# Altium project engine hours meter.PrjPcb
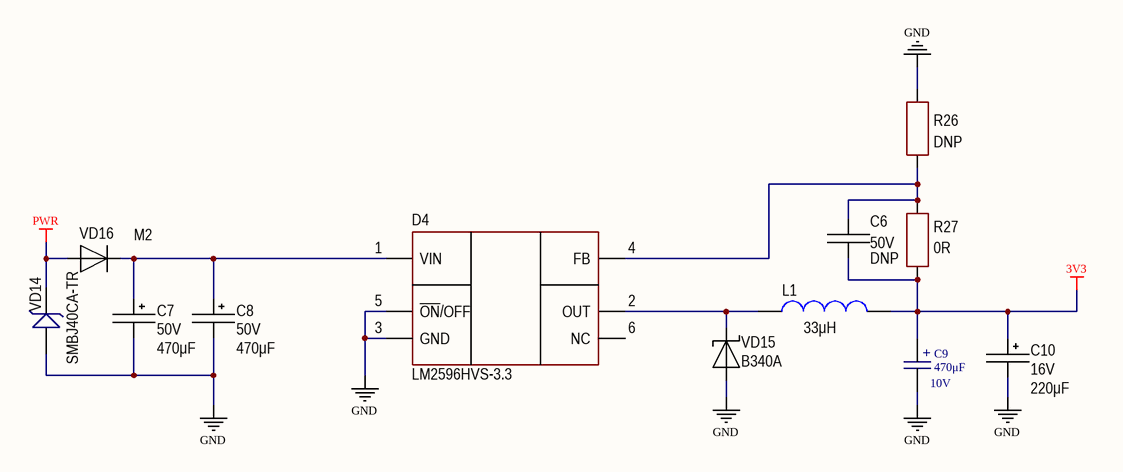
[diagram p0: Power.SchDoc]
6 sheets, 78 parts. Net scope: global (net labels, ports and power ports of the same name join across sheets).
Sheets:
  Power.SchDoc
  Input.SchDoc
  CAN.SchDoc
  Indicators.SchDoc
  Output.SchDoc
  MCU.SchDoc

## Sheet Power.SchDoc
size 420 x 297 mm; SheetNumber: 1; SheetTotal: 6

### Parts
C6  value DNP  Voltage: 50V  [CAP: 1206]
C7  value 470μF  Voltage: 50V  [CAP: D10C5H20]
C8  value 470μF  Voltage: 50V  [CAP: D10C5H20]
C9  value 470μF  Voltage: 10V  [CAP8x10.5]  (hidden comment: Capacitor_Polar)
C10  value 220μF  Voltage: 16V  [CAP: SMD D6.3A6.6H7.7]
D4  (no value)  [TO263-5L]
L1  value 33μH  [IND: SRP7028A]
R26  value DNP  [RES: 1206]
R27  value 0R  [RES: 1206]
VD14  value SMBJ40CA-TR  [SMB]  (hidden comment: suppressor)
VD15  PartNumber: B340A  [DIODE: SMA]
VD16  PartNumber: M2  [DIODE: SMA]

### Nets
3V3: C6.1 C9.1 C10.1 L1.1 R27.1
GND: C7.2 C8.2 C9.2 C10.2 D4.3(GND) D4.5(~{ON}/OFF) R26.2 VD14.2 VD15.1
PWR: VD14.1 VD16.1
NetC6_2: C6.2 D4.4(FB) R26.1 R27.2
NetC7_1: C7.1 C8.1 D4.1(VIN) VD16.2
NetD4_2: D4.2(OUT) L1.2 VD15.2

Not connected (* = marked no-connect by the designer): D4 6(NC)

### Notes on the sheet
- Подп. и дата
- Инв. № дубл.
- Взам. инв. №
- Инв. № подл.
- Изм.
- Лист
- № докум.
- Подп.
- Дата
- 2.106-A3
- Копировал
- Формат А3
- (in symbol Capacitor_Polar) +

### Library data of the parts
C6 = Ceramic_1206: Manufacturer: Yageo; PartNumber: CC1206KRX7R9BB104; ValueManufacturerPartNumber: Ceramic capacitor, DNP, X7R, ±10%, 50V, 1206, -55...+125°C; TypeCapacitor: Ceramic capacitor; Tolerance: ±10%; TypeDielectric: X7R; Package: 1206; HelpURL: https://www.digikey.com/product-detail/en/yageo/CC1206KRX7R9BB104/311-1179-1-ND/303089; Temperature: -55...+125°C
C7 C8 = Aluminium: ECAP (К50-35), 470мкФ, 50В, 105°C, 20%, 10x20мм P:5мм; Manufacturer: Wurth; ValueManufacturerPartNumber: Aluminium capacitor, 470μF, 50V, ±20%, 54mOhm, 14x10x5 mm, -55...+105°C; TypeCapacitor: Aluminium capacitor; Impedance: 54mOhm; PartNumber: ECAP (К50-35); Package: 14x10x5 mm; HelpURL: https://www.digikey.com/product-detail/en/wurth-electronics-inc/860080475013/732-9029-1-ND/5728972; Temperature: -55...+105°C; Tolerance: ±20%
C9 = Capacitor_Polar: PartNumber: JCK1A471M080105
C10 = Aluminium: Manufacturer: Wurth; PartNumber: JCK1C221M063077; ValueManufacturerPartNumber: Aluminium capacitor, 220μF, 16V, ±20%, 54mOhm, 14x10x5 mm, -55...+105°C; TypeCapacitor: Aluminium capacitor; Tolerance: ±20%; Impedance: 54mOhm; Package: 14x10x5 mm; HelpURL: https://www.digikey.com/product-detail/en/wurth-electronics-inc/860080475013/732-9029-1-ND/5728972; Temperature: -55...+105°C
D4 = LM2596HVS-3.3: Buck converter; Manufacturer: Texas Instruments; ValueManufacturerPartNumber: DC/DC buck converter, 45V, 52MHz, 3.3V, 5A, -40...+125°C, TO263-5L; VoltageInput: 45V; Frequency: 52MHz; CurrentOutput: 5A; VoltageOutput: 3.3V; Package: TO263-5L; ComponentType: DC/DC buck converter; Temperature: -40...+125°C; PartNumber: LM2596HVS-3.3
L1 = Inductor_SRP7028A: FAUL0630-330MT / BMRA00060630330MA1; Manufacturer: Bourns; PartNumber: SRP7028A-330M; ValueManufacturerPartNumber: Fixed inductor, 33μH, ±20%, SRP7028A, 5.5A, -40...+150°C; TypeInductor: Fixed inductor; MaxCurrent: 5.5A; Tolerance: ±20%; Package: SRP7028A; Temperature: -40...+150°C
R26 = Resistor_1206: Manufacturer: Yageo; PartNumber: RC1206JR-07100RL; ValueManufacturerPartNumber: Resistor film, DNP, ±5%, 1206, 0.25W, -55...+125°C; TypeResistor: Resistor film; Power: 0.25W; Tolerance: ±5%; Package: 1206; HelpURL: https://www.digikey.com/product-detail/en/yageo/RC1206JR-07100RL/311-100ERCT-ND/732153; Temperature: -55...+125°C
R27 = Resistor_1206: Manufacturer: Yageo; PartNumber: RC1206JR-07100RL; ValueManufacturerPartNumber: Resistor film, 0R, ±5%, 1206, 0.25W, -55...+125°C; TypeResistor: Resistor film; Power: 0.25W; Tolerance: ±5%; Package: 1206; HelpURL: https://www.digikey.com/product-detail/en/yageo/RC1206JR-07100RL/311-100ERCT-ND/732153; Temperature: -55...+125°C
VD15 = Schottky_single: ValueManufacturerPartNumber: Schottky diode, 80V, 500mA, 1V, 15pF, SMA, -55...+150°C; TypeDiode: Schottky diode; Voltage: 80V; Current: 500mA; VoltageDrop: 1V; RecoveryTime: 15pF; Package: SMA; HelpURL: https://www.chipdip.ru/product/b340a; Temperature: -55...+150°C
VD16 = Diode_single: Manufacturer: Micro Commercial; ValueManufacturerPartNumber: Single diode, 75V, 150mA, 1V, 4ns, SOD-323, -55...+150°C; TypeDiode: Single diode; Voltage: 75V; Current: 150mA; VoltageDrop: 1V; RecoveryTime: 4ns; Package: SOD-323; HelpURL: https://www.digikey.com/product-detail/en/micro-commercial-co/1N4148WX-TP/1N4148WXTPMSCT-ND/717312; Temperature: -55...+150°C

## Sheet Input.SchDoc
size 420 x 297 mm; SheetNumber: 2; SheetTotal: 6
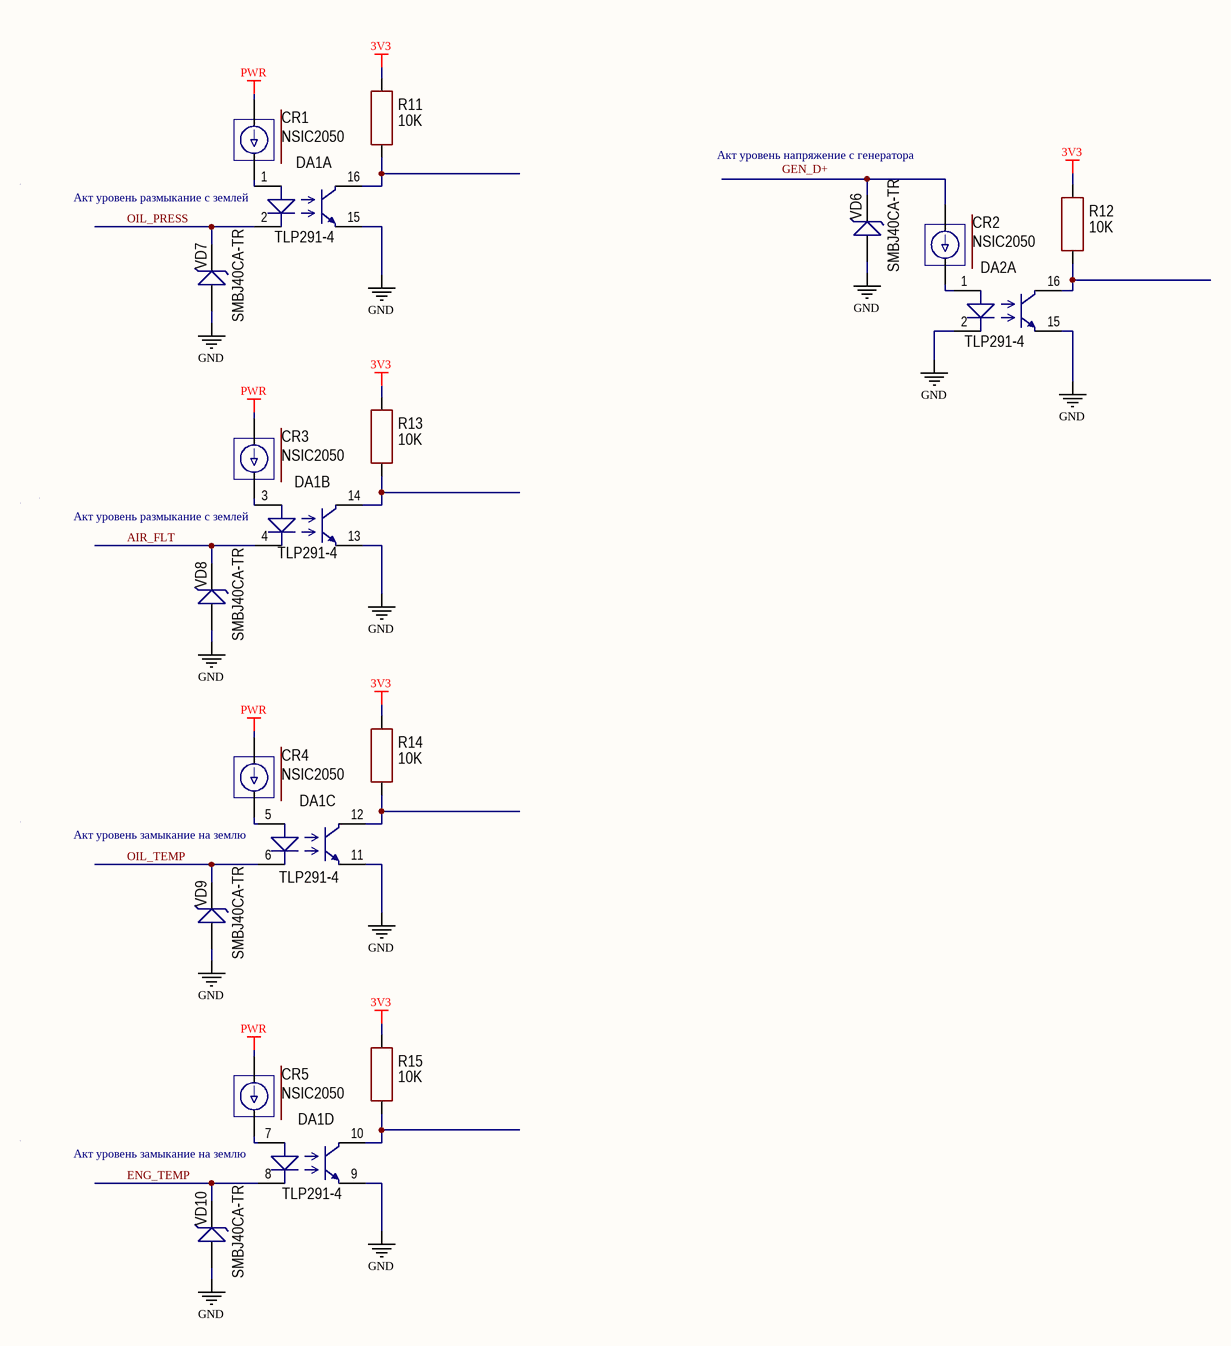
[diagram p1: Input.SchDoc]

### Parts
CR1  value NSIC2050  [SMB1]  (hidden comment: NSIC20XX)
CR2  value NSIC2050  [SMB1]  (hidden comment: NSIC20XX)
CR3  value NSIC2050  [SMB1]  (hidden comment: NSIC20XX)
CR4  value NSIC2050  [SMB1]  (hidden comment: NSIC20XX)
CR5  value NSIC2050  [SMB1]  (hidden comment: NSIC20XX)
DA1  TLP291-4  [SOP16]  (parts A,B,C,D of 4)
DA2  TLP291-4  [SOP16]  (part A of 4)
R11  value 10K  [RES: 1206]
R12  value 10K  [RES: 1206]
R13  value 10K  [RES: 1206]
R14  value 10K  [RES: 1206]
R15  value 10K  [RES: 1206]
VD6  value SMBJ40CA-TR  [SMB]  (hidden comment: suppressor)
VD7  value SMBJ40CA-TR  [SMB]  (hidden comment: suppressor)
VD8  value SMBJ40CA-TR  [SMB]  (hidden comment: suppressor)
VD9  value SMBJ40CA-TR  [SMB]  (hidden comment: suppressor)
VD10  value SMBJ40CA-TR  [SMB]  (hidden comment: suppressor)

### Nets
3V3: R11.2 R12.2 R13.2 R14.2 R15.2
GND: DA1.9 DA1.11 DA1.13 DA1.15 DA2.2 DA2.15 VD6.2 VD7.2 VD8.2 VD9.2 VD10.2
PWR: CR1.A CR3.A CR4.A CR5.A
AIR_FLT: DA1.4 VD8.1
ENG_TEMP: DA1.8 VD10.1
OIL_PRESS: DA1.2 VD7.1
OIL_TEMP: DA1.6 VD9.1
NetCR1_K: CR1.K DA1.1
NetCR2_A: CR2.A VD6.1
NetCR2_K: CR2.K DA2.1
NetCR3_K: CR3.K DA1.3
NetCR4_K: CR4.K DA1.5
NetCR5_K: CR5.K DA1.7
NetDA1_10: DA1.10 R15.1
NetDA1_12: DA1.12 R14.1
NetDA1_14: DA1.14 R13.1
NetDA1_16: DA1.16 R11.1
NetDA2_16: DA2.16 R12.1

### Notes on the sheet
- Акт уровень напряжение с генератора
- (near DA1) Акт уровень размыкание с землей
- Акт уровень замыкание на землю
- Labels drawn without touching a wire or pin: GEN_D+
- Подп. и дата
- Инв. № дубл.
- Взам. инв. №
- Инв. № подл.
- Изм.
- Лист
- № докум.
- Подп.
- Дата
- 2.106-A3
- Копировал
- Формат А3

### Library data of the parts
CR1-CR5 = NSIC20XX: pin to pad: A>2 K>1
R11-R15 = Resistor_1206: Manufacturer: Yageo; PartNumber: RC1206JR-07100RL; ValueManufacturerPartNumber: Resistor film, 10K, ±5%, 1206, 0.25W, -55...+125°C; TypeResistor: Resistor film; Power: 0.25W; Tolerance: ±5%; Package: 1206; HelpURL: https://www.digikey.com/product-detail/en/yageo/RC1206JR-07100RL/311-100ERCT-ND/732153; Temperature: -55...+125°C
DA1 DA2 = TLP291-4: Value: TLP291-4

## Sheet CAN.SchDoc
size 420 x 297 mm; SheetNumber: 3; SheetTotal: 6
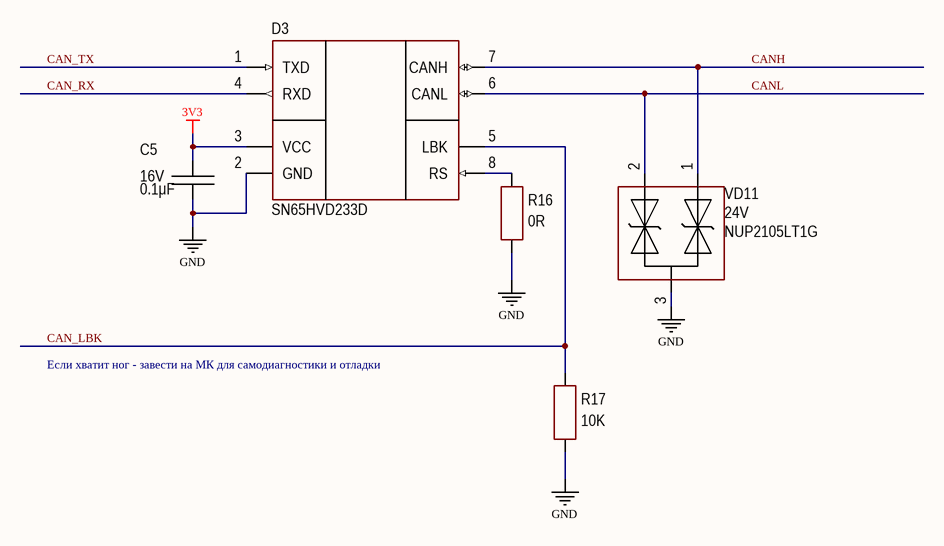
[diagram p2: CAN.SchDoc]

### Parts
C5  value 0.1μF  Voltage: 16V  [CAP: 0805]
D3  PartNumber: SN65HVD233D  [8-SOIC]
R16  value 0R  [RES: 1206]
R17  value 10K  [RES: 1206]
VD11  Voltage: 24V  PartNumber: NUP2105LT1G  [SOT23]

### Nets
3V3: C5.2 D3.3(VCC)
GND: C5.1 D3.2(GND) R16.1 R17.1 VD11.3
CAN_LBK: D3.5(LBK) R17.2
CAN_RX: D3.4(RXD)
CAN_TX: D3.1(TXD)
CANH: D3.7(CANH) VD11.1
CANL: D3.6(CANL) VD11.2
NetD3_8: D3.8(RS) R16.2

### Notes on the sheet
- Если хватит ног - завести на МК для самодиагностики и отладки
- Подп. и дата
- Инв. № дубл.
- Взам. инв. №
- Инв. № подл.
- Изм.
- Лист
- № докум.
- Подп.
- Дата
- 2.106-A3
- Копировал
- Формат А3

### Library data of the parts
C5 = Ceramic_0805: Manufacturer: Yageo; PartNumber: CC0805KRX7R7BB104; ValueManufacturerPartNumber: Ceramic capacitor, 0.1μF, X7R, ±10%, 16V, 0805, -55...+125°C; TypeCapacitor: Ceramic capacitor; Tolerance: ±10%; TypeDielectric: X7R; Package: 0805; HelpURL: https://www.digikey.com/product-detail/en/yageo/CC0805KRX7R7BB104/311-1142-1-ND/303052; Temperature: -55...+125°C
D3 = SN65HVD231DR: CAN; Manufacturer: Texas Instruments; ValueManufacturerPartNumber: IC CAN transceiver, 1Mbps, Half-duplex, 3...3.6V, -40...+85°C, 8-SOIC; Supply: 3...3.6V; DataRate: 1Mbps; TypeDuplex: Half-duplex; HelpURL: https://www.digikey.com/product-detail/en/texas-instruments/SN65HVD231DR/296-26343-1-ND/2254977; Package: 8-SOIC; ComponentType: IC CAN transceiver; Temperature: -40...+85°C
R16 = Resistor_1206: as R27 on sheet Power; Package: 1206; HelpURL: https://www.digikey.com/product-detail/en/yageo/RC1206JR-07100RL/311-100ERCT-ND/732153; Temperature: -55...+125°C
R17 = Resistor_1206: as R11 on sheet Input; Package: 1206; HelpURL: https://www.digikey.com/product-detail/en/yageo/RC1206JR-07100RL/311-100ERCT-ND/732153; Temperature: -55...+125°C
VD11 = TVS_array: Manufacturer: Diodes Incorporated; ValueManufacturerPartNumber: Zener diode, 24V, 500mW, 0.9V, 17Ohm, SOD-123, -55...+150°C; TypeDiode: Zener diode; Current: 500mW; VoltageDrop: 0.9V; RecoveryTime: 17Ohm; Package: SOD-123; HelpURL: https://www.digikey.com/product-detail/en/diodes-incorporated/MMSZ5231B-7-F/MMSZ5231B-FDICT-ND/755506; Temperature: -55...+150°C

## Sheet Indicators.SchDoc
size 420 x 297 mm; SheetNumber: 4; SheetTotal: 6
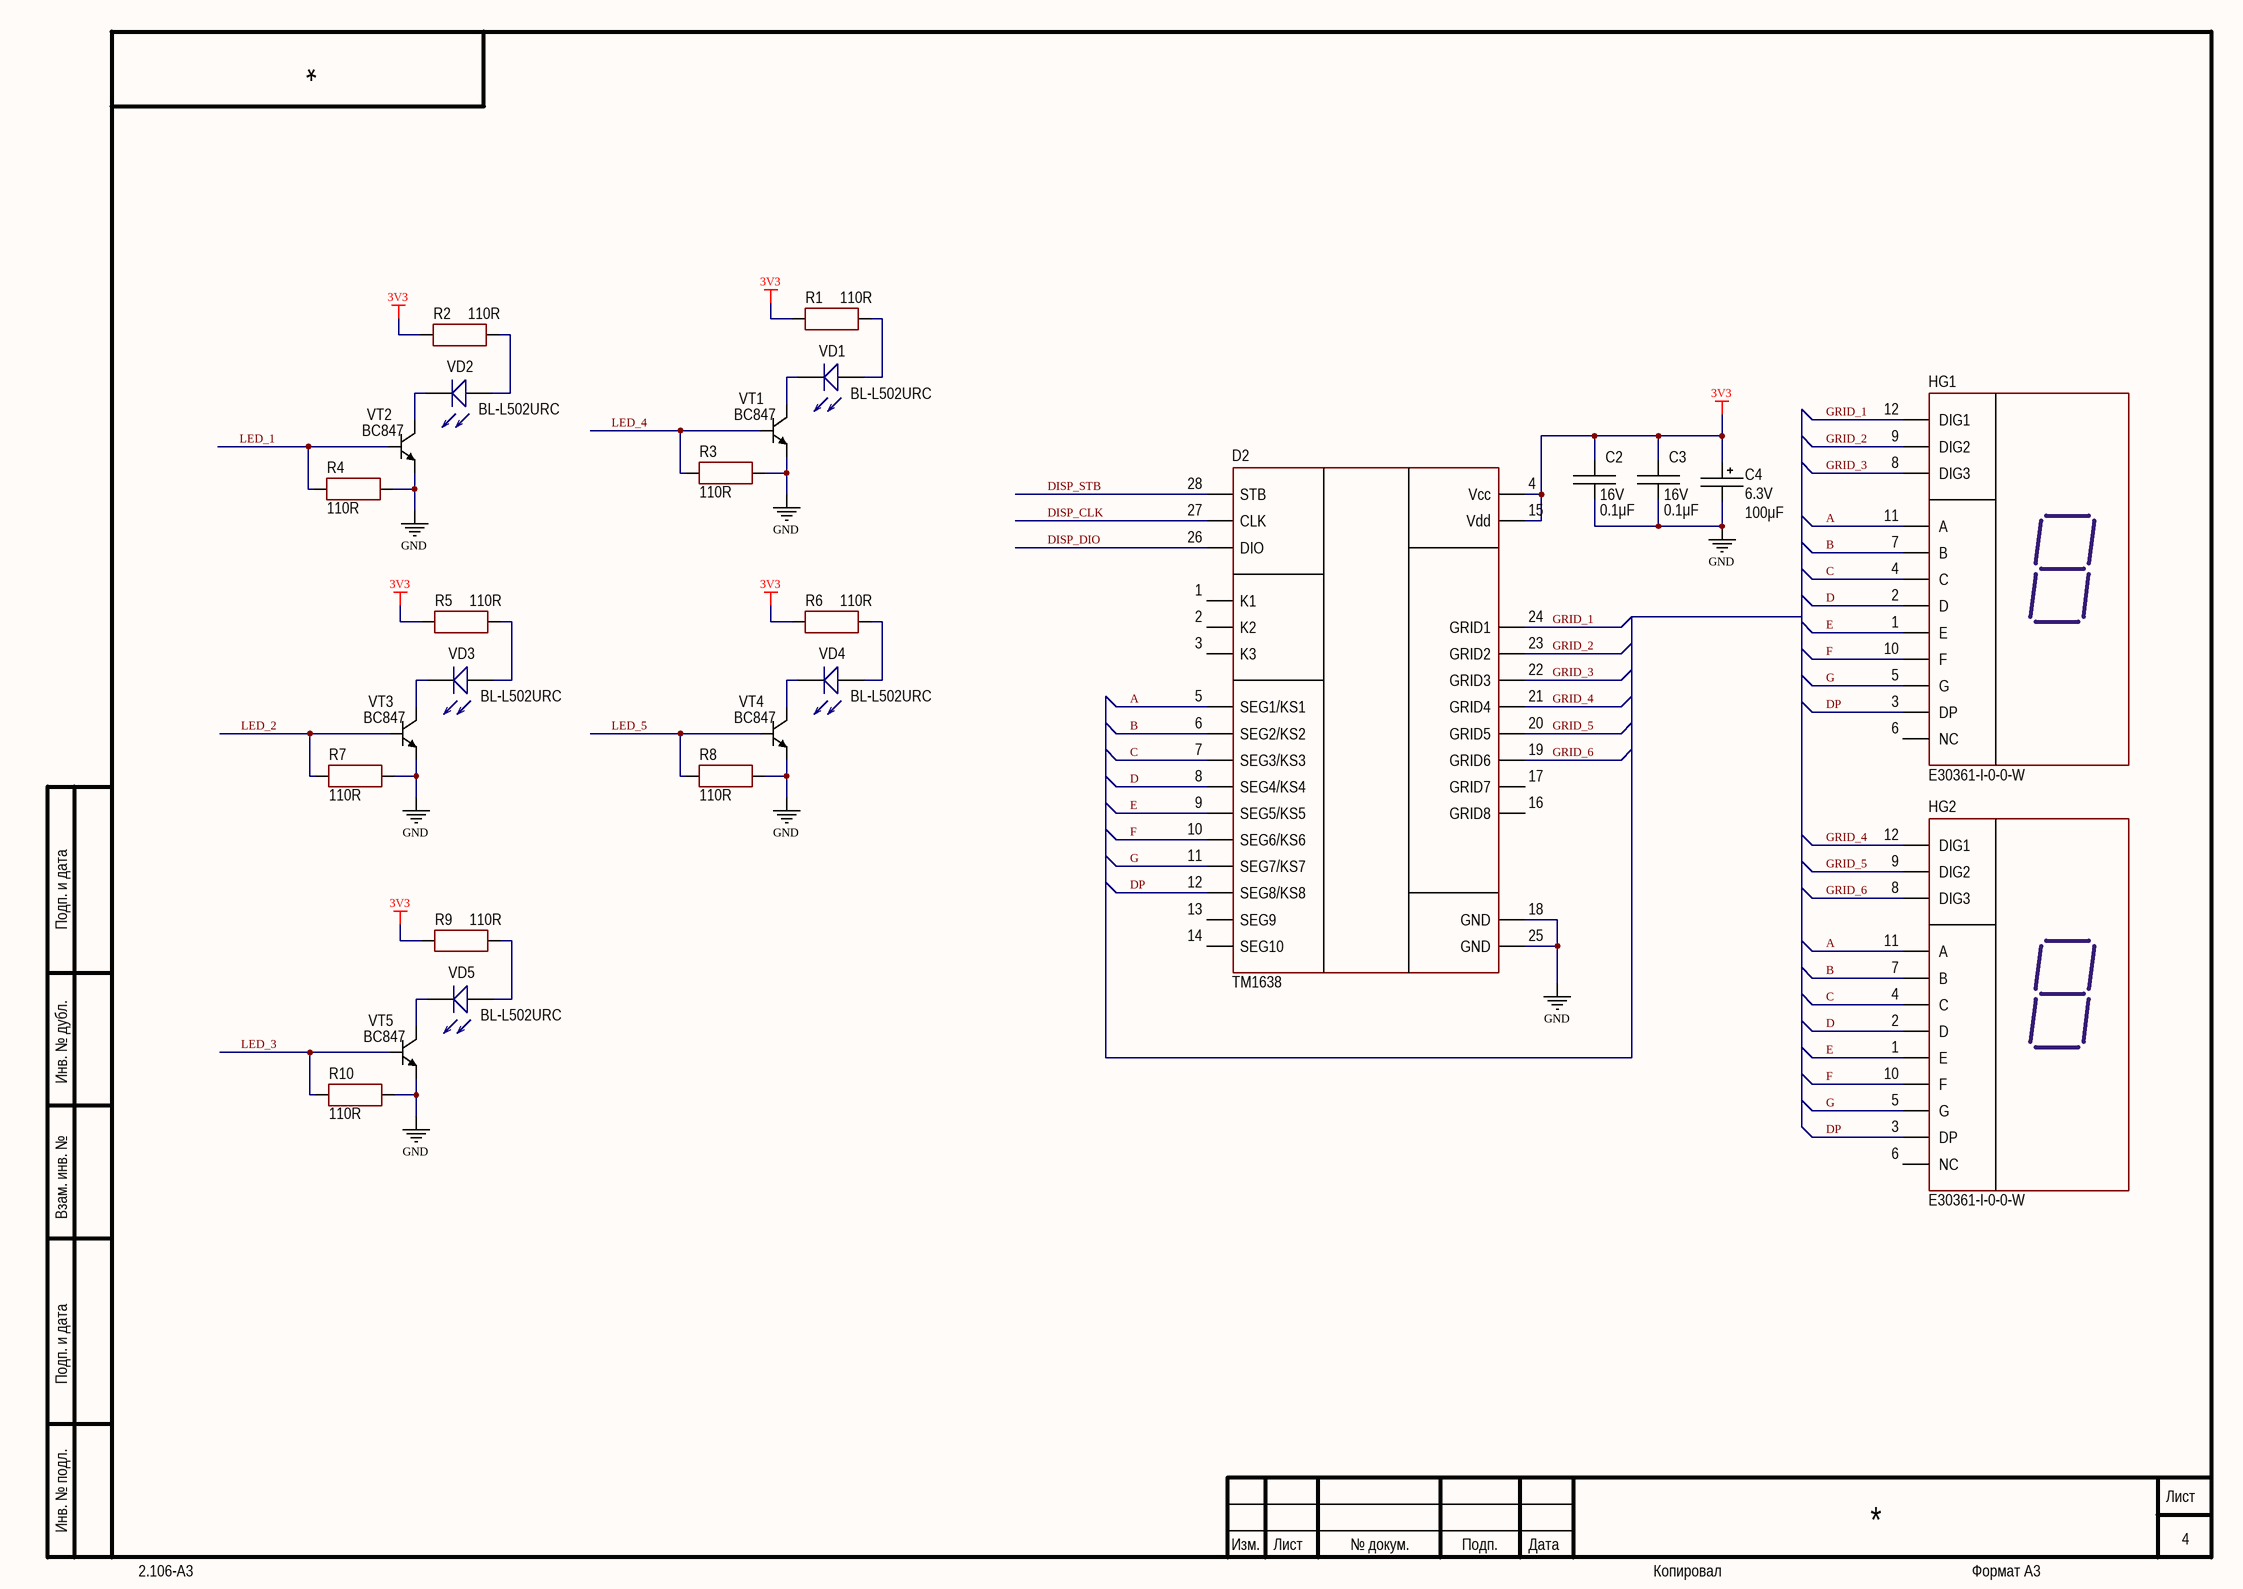
[diagram p3: Indicators.SchDoc]

### Parts
C2  value 0.1μF  Voltage: 16V  [CAP: 0805]
C3  value 0.1μF  Voltage: 16V  [CAP: 0805]
C4  value 100μF  Voltage: 6.3V  [CAP: TANTAL-C]
D2  (no value)  [28-SOP]
HG1  PartNumber: E30361-I-0-0-W  [DISP: CL3631BH - GREEN (0,36")]
HG2  PartNumber: E30361-I-0-0-W  [DISP: CL3631BH - GREEN (0,36")]
R1  value 110R  [RES: 1206]
R2  value 110R  [RES: 1206]
R3  value 110R  [RES: 1206]
R4  value 110R  [RES: 1206]
R5  value 110R  [RES: 1206]
R6  value 110R  [RES: 1206]
R7  value 110R  [RES: 1206]
R8  value 110R  [RES: 1206]
R9  value 110R  [RES: 1206]
R10  value 110R  [RES: 1206]
VD1  LED  [LED 5mm RED]  (value not drawn)
VD2  LED  [LED 5mm RED]  (value not drawn)
VD3  LED  [LED 5mm RED]  (value not drawn)
VD4  LED  [LED 5mm RED]  (value not drawn)
VD5  LED  [LED 5mm RED]  (value not drawn)
VT1  PartNumber: BC847  [SOT23]
VT2  PartNumber: BC847  [SOT23]
VT3  PartNumber: BC847  [SOT23]
VT4  PartNumber: BC847  [SOT23]
VT5  PartNumber: BC847  [SOT23]

### Nets
3V3: C2.2 C3.2 C4.1 D2.4(Vcc) D2.15(Vdd) R1.2 R2.2 R5.2 R6.2 R9.2
GND: C2.1 C3.1 C4.2 D2.18(GND) D2.25(GND) R3.1 R4.1 R7.1 R8.1 R10.1 VT1.2(E) VT2.2(E) VT3.2(E) VT4.2(E) VT5.2(E)
A: D2.5(SEG1/KS1) HG1.11(A) HG2.11(A)
B: D2.6(SEG2/KS2) HG1.7(B) HG2.7(B)
C: D2.7(SEG3/KS3) HG1.4(C) HG2.4(C)
D: D2.8(SEG4/KS4) HG1.2(D) HG2.2(D)
DISP_CLK: D2.27(CLK)
DISP_DIO: D2.26(DIO)
DISP_STB: D2.28(STB)
DP: D2.12(SEG8/KS8) HG1.3(DP) HG2.3(DP)
E: D2.9(SEG5/KS5) HG1.1(E) HG2.1(E)
F: D2.10(SEG6/KS6) HG1.10(F) HG2.10(F)
G: D2.11(SEG7/KS7) HG1.5(G) HG2.5(G)
GRID_1: D2.24(GRID1) HG1.12(DIG1)
GRID_2: D2.23(GRID2) HG1.9(DIG2)
GRID_3: D2.22(GRID3) HG1.8(DIG3)
GRID_4: D2.21(GRID4) HG2.12(DIG1)
GRID_5: D2.20(GRID5) HG2.9(DIG2)
GRID_6: D2.19(GRID6) HG2.8(DIG3)
LED_1: R4.2 VT2.1(B)
LED_2: R7.2 VT3.1(B)
LED_3: R10.2 VT5.1(B)
LED_4: R3.2 VT1.1(B)
LED_5: R8.2 VT4.1(B)
NetR1_1: R1.1 VD1.2
NetR2_1: R2.1 VD2.2
NetR5_1: R5.1 VD3.2
NetR6_1: R6.1 VD4.2
NetR9_1: R9.1 VD5.2
NetVD1_1: VD1.1 VT1.3(C)
NetVD2_1: VD2.1 VT2.3(C)
NetVD3_1: VD3.1 VT3.3(C)
NetVD4_1: VD4.1 VT4.3(C)
NetVD5_1: VD5.1 VT5.3(C)

Not connected (* = marked no-connect by the designer): D2 1(K1) 2(K2) 3(K3) 13(SEG9) 14(SEG10) 16(GRID8) 17(GRID7); HG1 6(NC); HG2 6(NC)

### Notes on the sheet
- Подп. и дата
- Инв. № дубл.
- Взам. инв. №
- Инв. № подл.
- Изм.
- Лист
- № докум.
- Подп.
- Дата
- 2.106-A3
- Копировал
- Формат А3

### Library data of the parts
C2 C3 = Ceramic_0805: as C5 on sheet CAN; Package: 0805; HelpURL: https://www.digikey.com/product-detail/en/yageo/CC0805KRX7R7BB104/311-1142-1-ND/303052; Temperature: -55...+125°C
C4 = Tantal_C: Manufacturer: AVX; PartNumber: F931E226MCC; ValueManufacturerPartNumber: Tantalum capacitor, 100μF, 6.3V, ±10%, 1.1Ohm, case C (6032), -55...+125°C; Impedance: 1.1Ohm; Tolerance: ±10%; TypeDielectric: X7R; TypeCapacitor: Tantalum capacitor; Package: case C (6032); HelpURL: https://www.digikey.com/product-detail/en/avx-corporation/F931E226MCC/478-8314-1-ND/4006045; Temperature: -55...+125°C
D2 = TM1638: 7-seg LED Driver; Manufacturer: TM(Shenzhen Titan Micro Elec); ValueManufacturerPartNumber: LED Display driver, 480 Mb/s, ULPI, USB, 3...3.6V, -40...+85°C, SOP-28; Supply: 3...3.6V; DataRate: 480 Mb/s; Protocol: ULPI, USB; HelpURL: https://www.lcsc.com/product-detail/span-style-background-color-ff0-LED-span-Display-Drivers_TM-Shenzhen-Titan-Micro-Elec-TM1638_C19187.html; Package: SOP-28; ComponentType: LED Display driver; Temperature: -40...+85°C; PartNumber: TM1638
HG1 HG2 = E30361: 7 segment LED indicator 3 dig; Package: 14х22,5; ComponentType: 7Seg LED; ValueManufacturerPartNumber: =ComponentType+', '+TypeStandart+', '+Core+', '+TypeInterface+', '+Temperature+', '+Package; Temperature: -40...+85°C
R1-R10 = Resistor_1206: Manufacturer: Yageo; PartNumber: RC1206JR-07100RL; ValueManufacturerPartNumber: Resistor film, 110R, ±5%, 1206, 0.25W, -55...+125°C; TypeResistor: Resistor film; Power: 0.25W; Tolerance: ±5%; Package: 1206; HelpURL: https://www.digikey.com/product-detail/en/yageo/RC1206JR-07100RL/311-100ERCT-ND/732153; Temperature: -55...+125°C
VD1-VD5 = LED: BL-L502URC; Value: LED; PartNumber: BL-L502URC
VT1-VT5 = BJT_NPN_132: Manufacturer: ON Semiconductor; ValueManufacturerPartNumber: NPN transistor, 45V, 100mA, 100MHz, 300mW, 0.6V, 420, SOT-23, -55...+125°C; TypeTransistor: NPN transistor; VoltageCE: 45V; CurrentCE: 100mA; VoltageSaturation: 0.6V; Frequency: 100MHz; CurrentGain: 420; MaxPower: 300mW; Package: SOT-23; HelpURL: https://www.digikey.com/product-detail/en/on-semiconductor/BC847CLT1G/BC847CLT1GOSCT-ND/917836; Temperature: -55...+125°C

## Sheet Output.SchDoc
size 420 x 297 mm; SheetNumber: 5; SheetTotal: 6
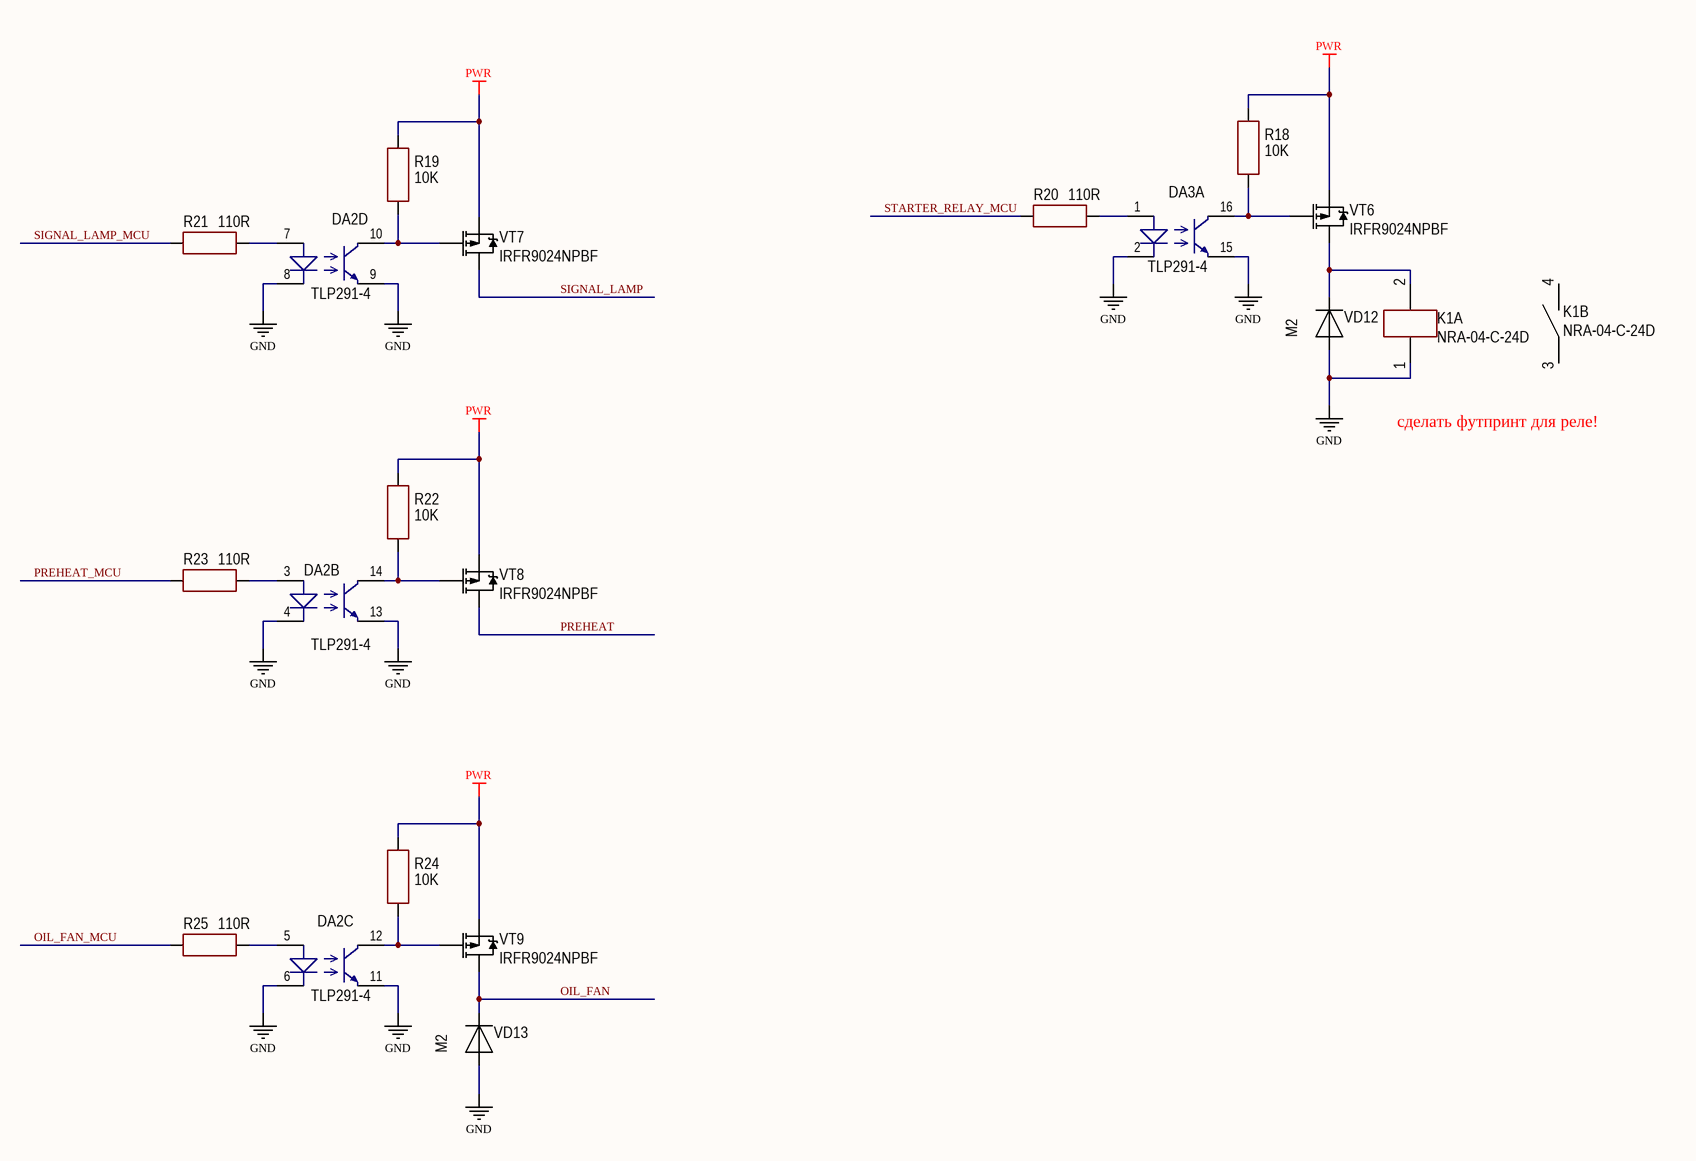
[diagram p4: Output.SchDoc]

### Parts
DA2  TLP291-4  [SOP16]  (parts B,C,D of 4)
DA3  TLP291-4  [SOP16]  (part A of 4)
K1  PartNumber: NRA-04-C-24D  [REL: T9GS1]  (parts A,B of 2)
R18  value 10K  [RES: 1206]
R19  value 10K  [RES: 1206]
R20  value 110R  [RES: 1206]
R21  value 110R  [RES: 1206]
R22  value 10K  [RES: 1206]
R23  value 110R  [RES: 1206]
R24  value 10K  [RES: 1206]
R25  value 110R  [RES: 1206]
VD12  PartNumber: M2  [DIODE: SMA]
VD13  PartNumber: M2  [DIODE: SMA]
VT6  PartNumber: IRFR9024NPBF  [DPAK]
VT7  PartNumber: IRFR9024NPBF  [DPAK]
VT8  PartNumber: IRFR9024NPBF  [DPAK]
VT9  PartNumber: IRFR9024NPBF  [DPAK]

### Nets
GND: DA2.4 DA2.6 DA2.8 DA2.9 DA2.11 DA2.13 DA3.2 DA3.15 K1.1 VD12.1 VD13.1
PWR: R18.2 R19.2 R22.2 R24.2 VT6.3(S) VT7.3(S) VT8.3(S) VT9.3(S)
OIL_FAN: VD13.2 VT9.2(D)
OIL_FAN_MCU: R25.2
PREHEAT: VT8.2(D)
PREHEAT_MCU: R23.2
SIGNAL_LAMP: VT7.2(D)
SIGNAL_LAMP_MCU: R21.2
STARTER_RELAY_MCU: R20.2
NetDA2_3: DA2.3 R23.1
NetDA2_5: DA2.5 R25.1
NetDA2_7: DA2.7 R21.1
NetDA2_10: DA2.10 R19.1 VT7.1(G)
NetDA2_12: DA2.12 R24.1 VT9.1(G)
NetDA2_14: DA2.14 R22.1 VT8.1(G)
NetDA3_1: DA3.1 R20.1
NetDA3_16: DA3.16 R18.1 VT6.1(G)
NetK1_2: K1.2 VD12.2 VT6.2(D)

Not connected (* = marked no-connect by the designer): K1 3 4

### Notes on the sheet
- сделать футпринт для реле!
- Подп. и дата
- Инв. № дубл.
- Взам. инв. №
- Инв. № подл.
- Изм.
- Лист
- № докум.
- Подп.
- Дата
- 2.106-A3
- Копировал
- Формат А3

### Library data of the parts
K1 = Relay_T9GS1L14: Manufacturer: TE Connectivity; ValueManufacturerPartNumber: Electromechanics relay, 12VDC, 480VAC, 30A, 1NO, -40...+85°C; TypeRelay: Electromechanics relay; VoltageMax: 480VAC; VoltageControlCoil: 12VDC; MaxCurrent: 30A; Package: 1NO; HelpURL: https://www.digikey.com/products/en?keywords=T9GS1L14-12; Temperature: -40...+85°C
R18 R19 R22 R24 = Resistor_1206: as R11 on sheet Input; Package: 1206; HelpURL: https://www.digikey.com/product-detail/en/yageo/RC1206JR-07100RL/311-100ERCT-ND/732153; Temperature: -55...+125°C
R20 R21 R23 R25 = Resistor_1206: as R1 on sheet Indicators; Package: 1206; HelpURL: https://www.digikey.com/product-detail/en/yageo/RC1206JR-07100RL/311-100ERCT-ND/732153; Temperature: -55...+125°C
VD12 VD13 = Diode_single: as VD16 on sheet Power; Package: SOD-323; HelpURL: https://www.digikey.com/product-detail/en/micro-commercial-co/1N4148WX-TP/1N4148WXTPMSCT-ND/717312; Temperature: -55...+150°C
VT6-VT9 = MOSFET_P_123: Manufacturer: Infineon Technologies; ValueManufacturerPartNumber: MOSFET P-channel transistor, 20V, 2.6A, 2.9nC, 2.5W, 135mOhm, 220pF, SOT-23, -55...+150°C; TypeTransistor: MOSFET P-channel transistor; VoltageDS: 20V; CurrentDS: 2.6A; RDS: 135mOhm; GateCharge: 2.9nC; InputCapacitor: 220pF; MaxPower: 2.5W; Package: SOT-23; HelpURL: https://www.digikey.com/product-detail/en/infineon-technologies/IRLML2246TRPBF/IRLML2246TRPBFCT-ND/2639576; Temperature: -55...+150°C
DA2 DA3 = TLP291-4: Value: TLP291-4

## Sheet MCU.SchDoc
size 420 x 297 mm; SheetNumber: 6; SheetTotal: 6
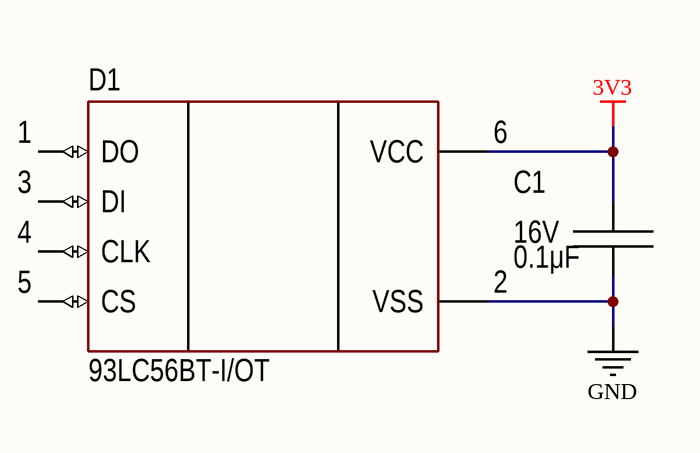
[diagram p5: MCU.SchDoc]

### Parts
C1  value 0.1μF  Voltage: 16V  [CAP: 0805]
D1  PartNumber: 93LC56BT-I/OT  [SOT23-6]

### Nets
3V3: C1.2 D1.6(VCC)
GND: C1.1 D1.2(VSS)

Not connected (* = marked no-connect by the designer): D1 1(DO) 3(DI) 4(CLK) 5(CS)

### Notes on the sheet
- Подп. и дата
- Инв. № дубл.
- Взам. инв. №
- Инв. № подл.
- Изм.
- Лист
- № докум.
- Подп.
- Дата
- 2.106-A3
- Копировал
- Формат А3

### Library data of the parts
C1 = Ceramic_0805: as C5 on sheet CAN; Package: 0805; HelpURL: https://www.digikey.com/product-detail/en/yageo/CC0805KRX7R7BB104/311-1142-1-ND/303052; Temperature: -55...+125°C
D1 = 93LC56BT: EEPROM; Manufacturer: Microchip Technology; ValueManufacturerPartNumber: IC memory, EEPROM, 2KB (256x8), 2 MHz, SPI, 2.5...5.5V, -40...+85°C, SOT-23-6; Supply: 2.5...5.5V; Speed: 2 MHz; InterfaceData: SPI; MemorySize: 2KB (256x8); HelpURL: https://www.digikey.com/product-detail/en/microchip-technology/93LC56BT-I-OT/93LC56BT-I-OTCT-ND/857632; Package: SOT-23-6; ComponentType: IC memory; Temperature: -40...+85°C; MemoryType: EEPROM

## Nets that join several sheets
3V3: Power (5 pins), Input (5 pins), CAN (C5.2 D3.3), Indicators (10 pins), MCU (C1.2 D1.6)
GND: Power (9 pins), Input (11 pins), CAN (5 pins), Indicators (15 pins), Output (11 pins), MCU (C1.1 D1.2)
PWR: Power (VD14.1 VD16.1), Input (CR1.A CR3.A CR4.A CR5.A), Output (8 pins)